# EasyEDA Pro project OURs_PHONE_EPRO_FILE_2025-04-21.epro, board 1-PCB_PCB_OURS PHONE_CONNECTORS_FLIP_1
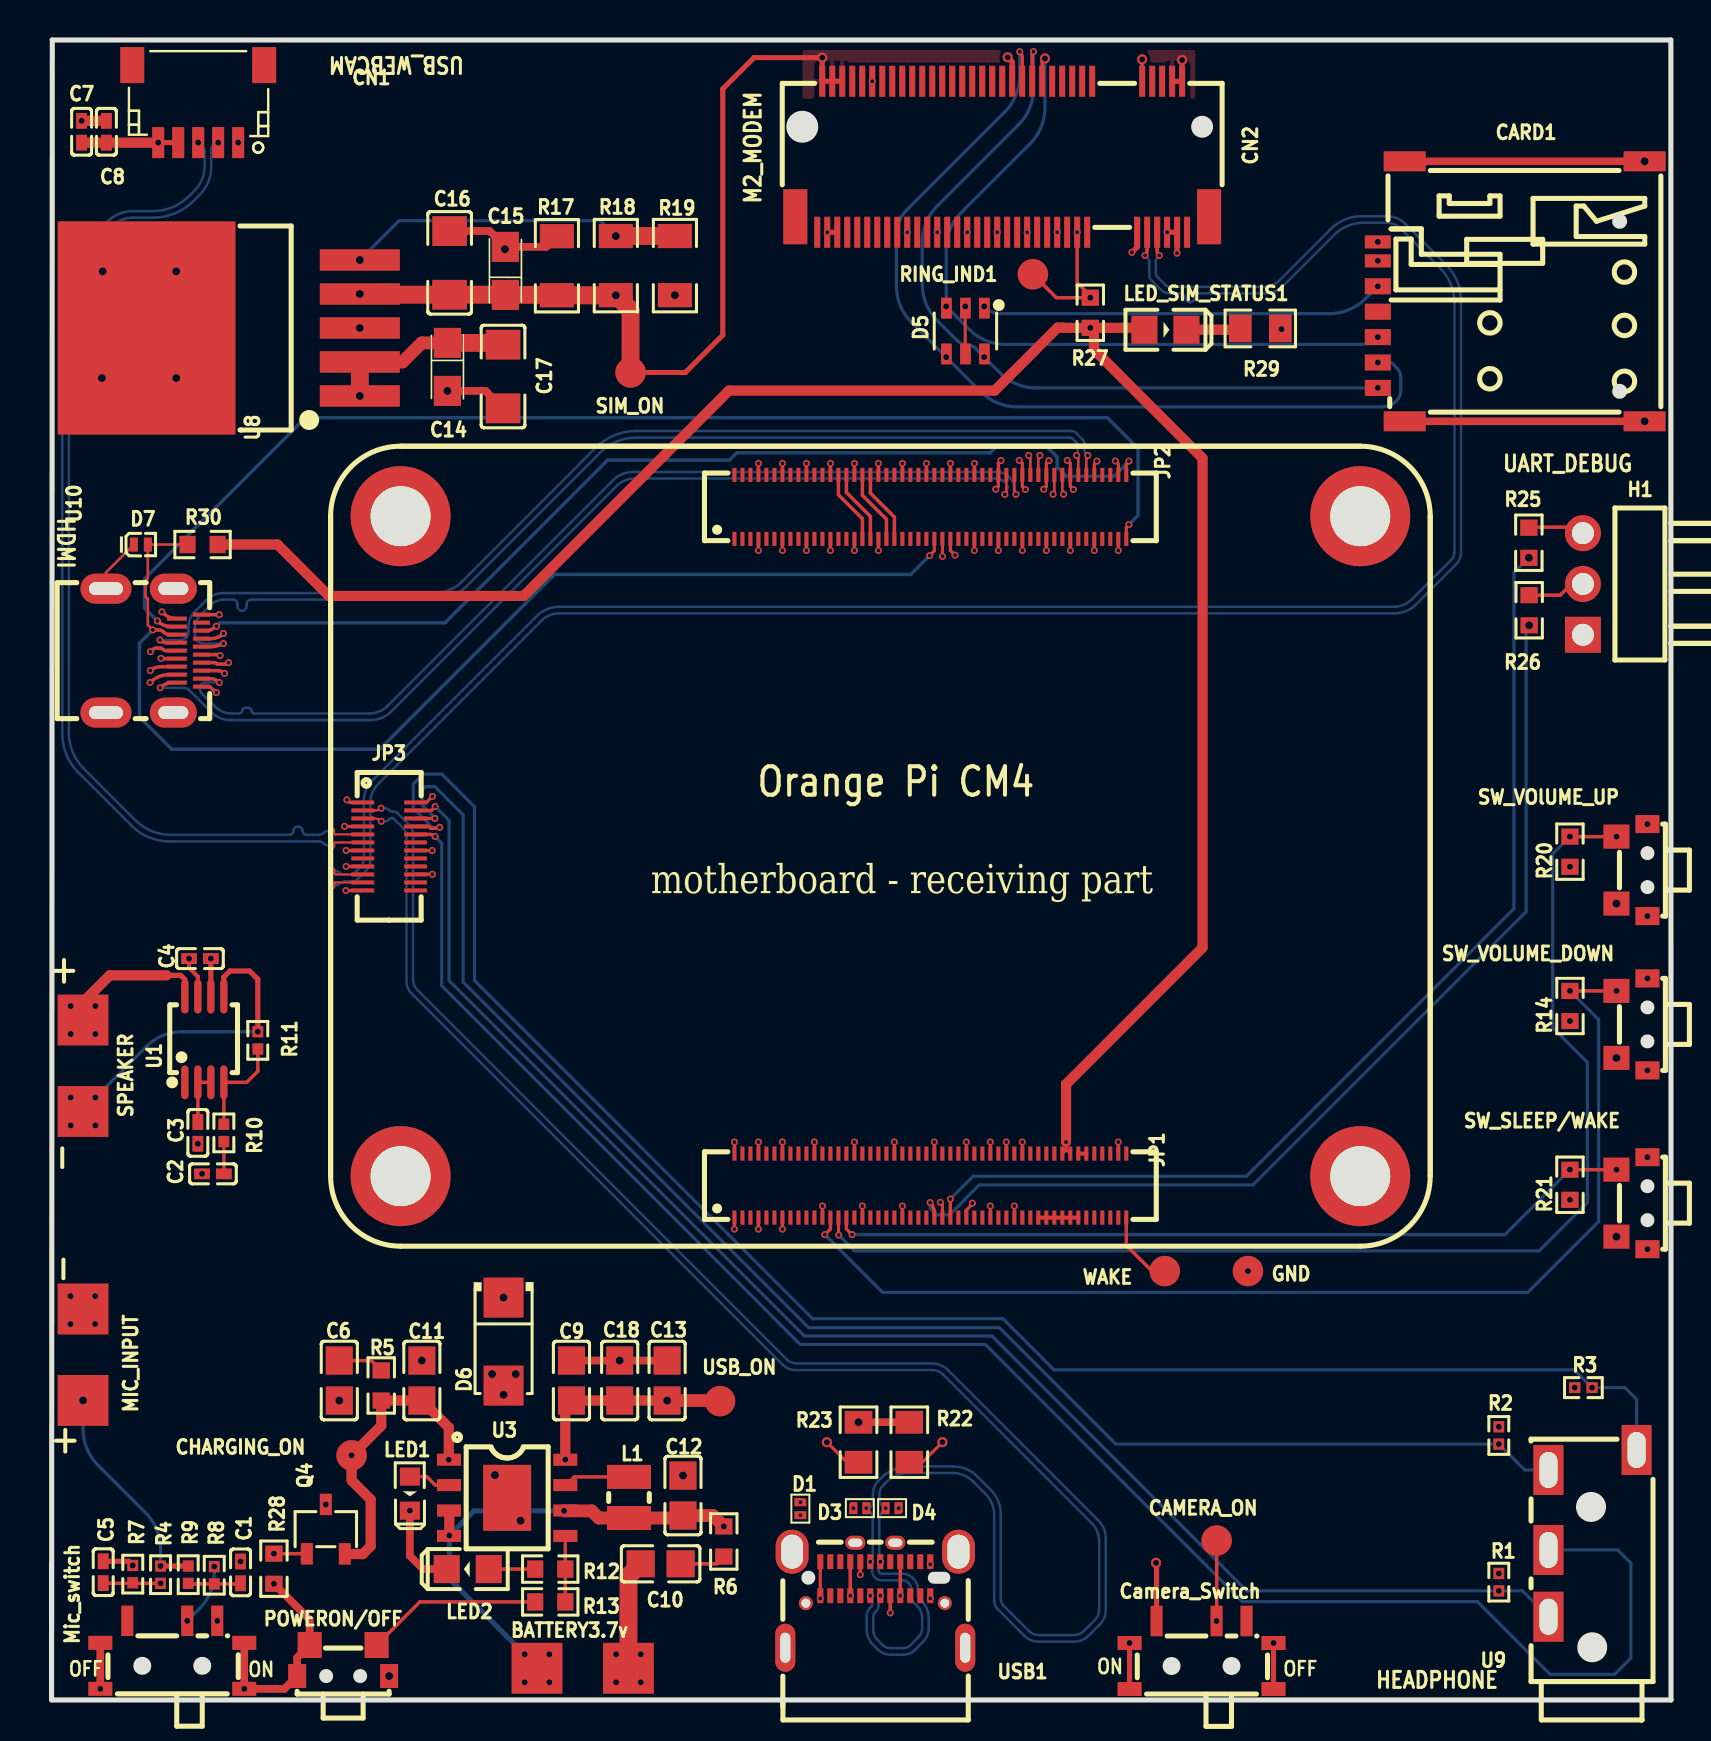
[diagram p12: board, top side]
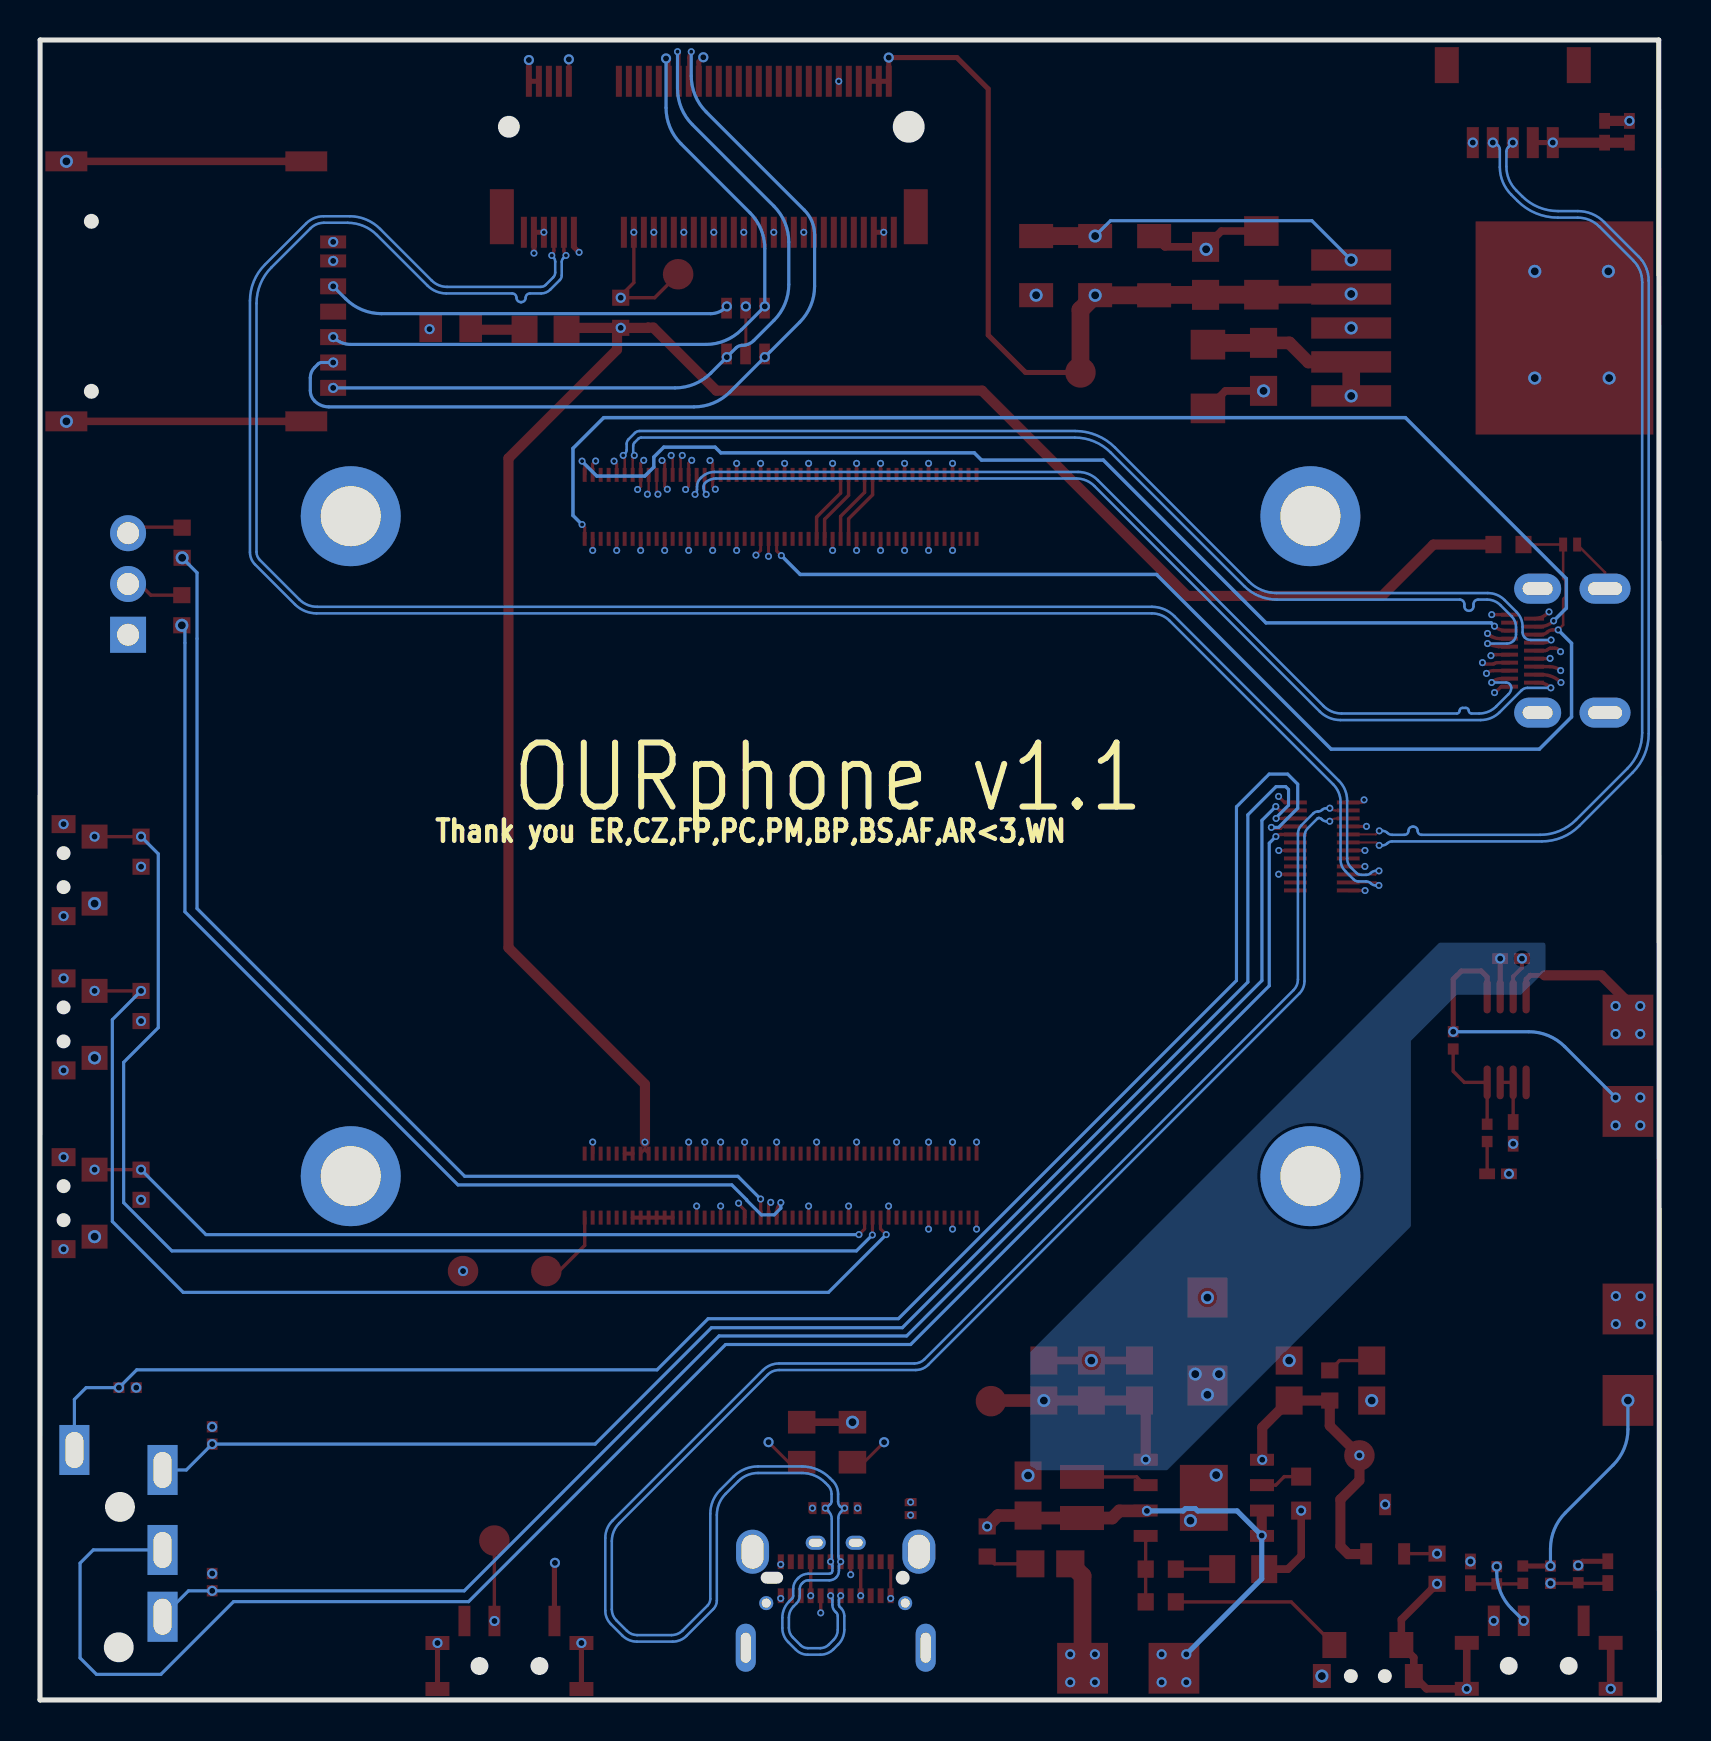
[diagram p13: board, bottom side, seen from below]

Outline 81 x 83 mm; copper layers: Top Layer, L2SP_INR, L3PN_GND, Bottom Layer. Coordinates in mm from the lower left corner of the outline.
Outline path: 0,0 0.03,83 80.99,83 81,0 0,0
Stack: Top Layer 0.035mm Outer layer thickness 1oz / Prepreg1 0.0994mm 3313 RC57% 4.2mil / L2SP_INR 0.0152mm Inner layer thickness / Core 1.265mm 1.3mm H/HOZ with Copper / L3PN_GND 0.0152mm Inner layer thickness / Prepreg2 0.0994mm 3313 RC57% 4.2mil / Bottom Layer 0.035mm Outer layer thickness 1oz

## Design rules (mm)
net HDMI_TX2_P: DP4
net HDMI_TX2_N: DP4
net HDMI_TX1_P: DP3
net HDMI_TX1_N: DP3
net HDMI_TX0_P: DP1
net HDMI_TX0_N: DP1
net HDMI_TXCLK_P: DP2
net HDMI_TXCLK_N: DP2
net USB2_HOST2_N: DP6
net USB2_HOST2_P: DP6
net USB3_HOST1_P: DP5
net USB3_HOST1_N: DP5
net USB2_HOST3_P: DP7
net USB2_HOST3_N: DP7
template: User Custom Config
spacing Default (default): track to track 0.076, other pairs 0 to 0.152
track width Default (default): min 0.051, default 0.127, max 1.27
differential pair Default (default): width min 0.107, default 0.107, max 0.124; gap min 0.203, default 0.203
via Default (default): diameter min 0.178, default 0.762, max 100.025; hole min 0.15, default 0.61, max 59.995

## Placement (name value [footprint] x y rotation side)
BATTERY3.7v  NOB  [BATTERY SYMBOL]  30.12 0.44 0 top
C1  10uF  [C0402]  9.45 6.38 270 top
C2  390nF  [C0402]  8.07 26.31 0 top
C3  1uF  [C0402]  7.31 28.35 90 top
C4  1uF  [C0402]  7.42 37.07 0 top
C5  100nF  [C0402]  2.58 6.39 270 top
C6  10uF  [C0805]  14.39 15.97 90 top
C7  100nF  [C0402]  1.5 78.41 270 top
C8  10uF  [C0402]  2.74 78.41 90 top
C9  22uF  [C0805]  26 15.97 270 top
C10  10uF  [C0805]  30.46 6.81 0 top
C11  10uF  [C0805]  18.52 15.97 270 top
C12  10uF  [C0805]  31.58 10.22 270 top
C13  22uF  [C0805]  30.79 15.97 270 top
C14  100uF  [CASE-A_3216]  19.8 66.65 270 top
C15  330uF  [CASE-A_3216]  22.7 71.46 90 top
C16  0.1u  [C1206]  19.91 71.86 270 top
C17  1uF  [C1206]  22.58 66.17 90 top
C18  22uF  [C0805]  28.41 15.97 270 top
CAMERA_ON  TP-橘色测试点  [TESTPOINT-TH_BD3.2]  58.27 7.97 180 top
Camera_Switch  HX MSK12C02-HB  [SW-SMD_MSK12C02-HB]  57.52 2.25 0 top
CARD1  SMN-303  [SIM-SMD_SMN-303]  73.01 70.43 90 top
CHARGING_ON  TP-橘色测试点  [TESTPOINT-TH_BD3.2]  15 12.23 270 top
CN1  SM05B-SRSS-TB (LF)(SN)  [CONN-SMD_SM05B-SRSS-TB-LF-SN]  7.33 79.81 180 top
CN2  AS0BC21-S30BB-7H  [CONN-SMD_AS0BC21-S30BB-7H]  47.55 77.16 180 top
D1  AZ5825-01F  [DFN-2L_L1.0-W0.6-P0.65-BI]  37.45 9.57 270 top
D3  AZ5825-01F  [DFN-2L_L1.0-W0.6-P0.65-BI]  40.43 9.59 0 top
D4  AZ5825-01F  [DFN-2L_L1.0-W0.6-P0.65-BI]  42.04 9.59 180 top
D5  DT1042-04SO-7  [SOT-26_L3.0-W1.6-P0.95-LS2.8-BL]  45.71 68.45 180 top
D6  M7  [SMA_L4.3-W2.6-LS5.2-RD]  22.61 17.92 270 top
D7  PESD5V0S1UL,315  [SOD-882_L1.0-W0.6-RD]  4.46 57.77 0 top
GND  TP-橘色测试点  [TESTPOINT-TH_BD3.2]  59.84 21.44 0 top
H1  PZ254R-11-03P  [HDR-TH_3P-P2.54-H-M-W10.4]  76.59 55.8 90 top
JP1  DF40C-100DS-0.4V(51)  [CONN-SMD_DF40C-100DS-0.4V-51]  43.95 25.72 180 top
JP2  DF40C-100DS-0.4V(51)  [CONN-SMD_DF40C-100DS-0.4V-51]  43.95 59.66 180 top
JP3  DF40C-24DS-0.4V(51)  [CONN-SMD_DF40C-24DS-0.4V51]  16.88 42.68 90 top
L1  1uH  [IND-SMD_L2.5-W2.0]  28.88 10.12 90 top
LED1  LED-0603_G  [LED0603_GREEN]  17.92 10.32 270 top
LED2  LED-0805_G  [LED0805_GREEN]  20.81 6.54 180 top
LED_SIM_STATUS1  LED-0805_B  [LED0805_BLUE]  55.71 68.51 0 top
MIC_INPUT  NOB  [BATTERY SYMBOL]  2.72 20.82 90 top
Mic_switch  HX MSK12C02-HB  [SW-SMD_MSK12C02-HB]  6.03 2.26 0 top
NOREF  -  [Pad_e1061]  65.46 59.19 0 top
NOREF#2  -  [Pad_e1064]  17.46 59.19 0 top
NOREF#3  -  [Pad_e1063]  17.46 26.19 0 top
NOREF#4  -  [Pad_e1062]  65.46 26.19 0 top
POWERON/OFF  TS24CA  [SW-SMD_TS24CA]  14.58 1.97 180 top
Q4  IRLML6344TRPBF  [SOT-23-3_L2.9-W1.6-P1.90-LS2.8-BR]  13.72 8.54 270 top
R1  470Ω  [R0402]  72.39 5.89 270 top
R2  470Ω  [R0402]  72.39 13.23 270 top
R3  0Ω  [R0402]  76.62 15.62 0 top
R4  100kΩ  [R0402]  5.45 6.26 270 top
R5  2R  [R0603]  16.49 15.72 90 top
R6  2R  [R0603]  33.62 7.92 270 top
R7  100kΩ  [R0402]  4.06 6.29 270 top
R8  22Ω  [R0402]  8.14 6.24 90 top
R9  2.2kΩ  [R0402]  6.83 6.26 270 top
R10  20kΩ  [R0402]  8.61 28.35 90 top
R11  20kΩ  [R0402]  10.31 32.98 270 top
R12  20R  [R0603]  24.94 6.54 180 top
R13  10K  [R0603]  24.94 4.9 180 top
R14  10K  [R0603]  75.94 34.7 90 top
R17  470  [R1206]  25.27 71.71 90 top
R18  100K  [R1206]  28.22 71.72 90 top
R19  47K  [R1206]  31.18 71.72 270 top
R20  10K  [R0603]  75.94 42.42 90 top
R21  10K  [R0603]  75.94 25.76 90 top
R22  5.1K  [R0805]  42.9 12.89 90 top
R23  5.1K  [R0805]  40.36 12.89 270 top
R25  1kΩ  [R0603]  73.89 57.86 90 top
R26  1kΩ  [R0603]  73.9 54.49 90 top
R27  10K  [R0603]  51.95 69.36 90 top
R28  10K  [R0603]  11.12 6.56 90 top
R29  100Ω  [R0805]  60.46 68.58 180 top
R30  10K  [R0603]  7.55 57.77 0 top
RING_IND1  TP-橘色测试点  [TESTPOINT-TH_BD3.2]  49.08 71.29 180 top
SIM_ON  TP-橘色测试点  [TESTPOINT-TH_BD3.2]  28.96 66.38 0 top
SPEAKER  NOB  [BATTERY SYMBOL]  0.43 28.16 270 top
SW_SLEEP/WAKE  TS24CA  [SW-SMD_TS24CA]  79.05 24.84 270 top
SW_VOLUME_DOWN  TS24CA  [SW-SMD_TS24CA]  79.05 33.78 270 top
SW_VOlUME_UP  TS24CA  [SW-SMD_TS24CA]  79.05 41.49 270 top
U1  LM4990MM/NOPB  [MSOP-8_L3.0-W3.0-P0.65-LS5.0-BL]  7.64 33.03 0 top
U3  IP5306  [ESOP-8_L4.9-W3.9-P1.27-LS6.0-BL-EP]  22.79 10.11 270 top
U8  MIC29302WU  [TO-263-5_L10.2-W9.9-P1.70-LS14.4-TL]  10.08 68.6 180 top
U9  PJ-3200B-4A  [AUDIO-TH_PJ-3200B-4A]  77.07 8.33 90 top
U10  GT-HD004A-PNNG0  [HDMI-SMD_GT-HD004A-FNNG0]  5.11 52.47 270 top
USB1  UT12113-11601-7H  [USB-C-SMD_UT12113-11601-7H]  41.2 5.24 0 top
USB_ON  TP-橘色测试点  [TESTPOINT-TH_BD3.2]  33.43 14.94 270 top
WAKE  TP-橘色测试点  [TESTPOINT-TH_BD3.2]  55.68 21.44 0 top

## Footprints (pads in the part's own frame, mm; a bottom-side part is the same pattern mirrored in y, then rotated)
AUDIO-TH_PJ-3200B-4A
  rect 2.5x1.5 hole 1.8x0.9: 1(4.17,-2.204) 2(3.17,2.204) 3(-4.17,2.204) 4(-0.831,2.204)
BATTERY SYMBOL
  rect 2.54x2.54 smd: 1(-5.842,1.143) 2(-1.27,1.143)
C0402
  rect 0.79x0.54 smd: 1(-0.545,0) 2(0.545,0)
C0805
  rect 1.41x1.35 smd: 1(-1,0) 2(1,0)
C1206
  rect 1.485x1.728 smd: 1(-1.593,0) 2(1.593,0)
CASE-A_3216
  rect 1.5x1.359 smd: 1(-1.2,0) 2(1.2,0)
CONN-SMD_AS0BC21-S30BB-7H
  rect 0.3x1.55 smd: 1(-9.25,3.775) 2(-9,-3.775) 3(-8.75,3.775) 4(-8.5,-3.775) 5(-8.25,3.775) 6(-8,-3.775) 7(-7.75,3.775) 8(-7.5,-3.775) 9(-7.25,3.775) 10(-7,-3.775) 11(-6.75,3.775) 20(-4.5,-3.775) 21(-4.25,3.775) 22(-4,-3.775) 23(-3.75,3.775) 24(-3.5,-3.775) 25(-3.25,3.775) 26(-3,-3.775) 27(-2.75,3.775) 28(-2.5,-3.775) 29(-2.25,3.775) 30(-2,-3.775) 31(-1.75,3.775) 32(-1.5,-3.775) 33(-1.25,3.775) 34(-1,-3.775) 35(-0.75,3.775) 36(-0.5,-3.775) 37(-0.25,3.775) 38(0,-3.775) 39(0.25,3.775) 40(0.5,-3.775) 41(0.75,3.775) 42(1,-3.775) 43(1.25,3.775) 44(1.5,-3.775) 45(1.75,3.775) 46(2,-3.775) 47(2.25,3.775) 48(2.5,-3.775) 49(2.75,3.775) 50(3,-3.775) 51(3.25,3.775) 52(3.5,-3.775) 53(3.75,3.775) 54(4,-3.775) 55(4.25,3.775) 56(4.5,-3.775) 57(4.75,3.775) 58(5,-3.775) 59(5.25,3.775) 60(5.5,-3.775) 61(5.75,3.775) 62(6,-3.775) 63(6.25,3.775) 64(6.5,-3.775) 65(6.75,3.775) 66(7,-3.775) 67(7.25,3.775) 68(7.5,-3.775) 69(7.75,3.775) 70(8,-3.775) 71(8.25,3.775) 72(8.5,-3.775) 73(8.75,3.775) 74(9,-3.775) 75(9.25,3.775)
  rect 1.2x2.75 smd: 76(10.35,3) 77(-10.35,3)
CONN-SMD_DF40C-24DS-0.4V51
  rect 0.2x1.14 smd: 1(2.2,1.32) 2(2.2,-1.32) 3(1.8,1.32) 4(1.8,-1.32) 5(1.4,1.32) 6(1.4,-1.32) 7(1,1.32) 8(1,-1.32) 9(0.6,1.32) 10(0.6,-1.32) 11(0.2,1.32) 12(0.2,-1.32) 13(-0.2,1.32) 14(-0.2,-1.32) 15(-0.6,1.32) 16(-0.6,-1.32) 17(-1,1.32) 18(-1,-1.32) 19(-1.4,1.32) 20(-1.4,-1.32) 21(-1.8,1.32) 22(-1.8,-1.32) 23(-2.2,1.32) 24(-2.2,-1.32)
CONN-SMD_DF40C-100DS-0.4V-51
  rect 0.2x0.7 smd: 1(9.8,1.6) 2(9.8,-1.6) 3(9.4,1.6) 4(9.4,-1.6) 5(9,1.6) 6(9,-1.6) 7(8.6,1.6) 8(8.6,-1.6) 9(8.2,1.6) 10(8.2,-1.6) 11(7.8,1.6) 12(7.8,-1.6) 13(7.4,1.6) 14(7.4,-1.6) 15(7,1.6) 16(7,-1.6) 17(6.6,1.6) 18(6.6,-1.6) 19(6.2,1.6) 20(6.2,-1.6) 21(5.8,1.6) 22(5.8,-1.6) 23(5.4,1.6) 24(5.4,-1.6) 25(5,1.6) 26(5,-1.6) 27(4.6,1.6) 28(4.6,-1.6) 29(4.2,1.6) 30(4.2,-1.6) 31(3.8,1.6) 32(3.8,-1.6) 33(3.4,1.6) 34(3.4,-1.6) 35(3,1.6) 36(3,-1.6) 37(2.6,1.6) 38(2.6,-1.6) 39(2.2,1.6) 40(2.2,-1.6) 41(1.8,1.6) 42(1.8,-1.6) 43(1.4,1.6) 44(1.4,-1.6) 45(1,1.6) 46(1,-1.6) 47(0.6,1.6) 48(0.6,-1.6) 49(0.2,1.6) 50(0.2,-1.6) 51(-0.2,1.6) 52(-0.2,-1.6) 53(-0.6,1.6) 54(-0.6,-1.6) 55(-1,1.6) 56(-1,-1.6) 57(-1.4,1.6) 58(-1.4,-1.6) 59(-1.8,1.6) 60(-1.8,-1.6) 61(-2.2,1.6) 62(-2.2,-1.6) 63(-2.6,1.6) 64(-2.6,-1.6) 65(-3,1.6) 66(-3,-1.6) 67(-3.4,1.6) 68(-3.4,-1.6) 69(-3.8,1.6) 70(-3.8,-1.6) 71(-4.2,1.6) 72(-4.2,-1.6) 73(-4.6,1.6) 74(-4.6,-1.6) 75(-5,1.6) 76(-5,-1.6) 77(-5.4,1.6) 78(-5.4,-1.6) 79(-5.8,1.6) 80(-5.8,-1.6) 81(-6.2,1.6) 82(-6.2,-1.6) 83(-6.6,1.6) 84(-6.6,-1.6) 85(-7,1.6) 86(-7,-1.6) 87(-7.4,1.6) 88(-7.4,-1.6) 89(-7.8,1.6) 90(-7.8,-1.6) 91(-8.2,1.6) 92(-8.2,-1.6) 93(-8.6,1.6) 94(-8.6,-1.6) 95(-9,1.6) 96(-9,-1.6) 97(-9.4,1.6) 98(-9.4,-1.6) 99(-9.8,1.6) 100(-9.8,-1.6)
CONN-SMD_SM05B-SRSS-TB-LF-SN
  rect 0.6x1.55 smd: 1(-2,1.938) 2(-0.999,1.938) 3(0.001,1.938) 4(1,1.938) 5(2.001,1.938)
  rect 1.2x1.8 smd: 6(-3.3,-1.938) 7(3.3,-1.938)
DFN-2L_L1.0-W0.6-P0.65-BI
  custom 0.41x0.6 smd: 1(-0.325,0)
  rect 0.4x0.6 smd: 2(0.325,0)
ESOP-8_L4.9-W3.9-P1.27-LS6.0-BL-EP
  rect 0.6x1.2 smd: 1(-1.905,-2.909) 2(-0.635,-2.909) 3(0.635,-2.909) 4(1.905,-2.909) 5(1.905,2.909) 6(0.635,2.909) 7(-0.635,2.909) 8(-1.905,2.909)
  rect 3.3x2.4 smd: 9(0,0)
HDMI-SMD_GT-HD004A-FNNG0
  rect 0.2x0.85 smd: 1(1.8,2.388) 3(1.4,2.388) 5(1,2.388) 7(0.6,2.388) 9(0.2,2.388) 11(-0.2,2.388) 13(-0.6,2.388) 15(-1,2.388) 17(-1.4,2.388) 19(-1.8,2.388)
  rect 0.2x1 smd: 2(1.6,1.163) 4(1.2,1.163) 6(0.8,1.163) 8(0.4,1.163) 10(0,1.163) 12(-0.4,1.163) 14(-0.8,1.163) 16(-1.2,1.163) 18(-1.6,1.163)
  oval 1.5x2.35 hole 0.65x1.5: 20(-3.1,0.983) 20(3.1,0.983)
  oval 1.5x2.55 hole 0.65x1.7: 21(-3.1,-2.388) 21(3.1,-2.388)
HDR-TH_3P-P2.54-H-M-W10.4
  rect 1.8x1.8 hole 1.1: 1(-2.54,0)
  round 1.8 hole 1.1: 2(0,0) 3(2.54,0)
IND-SMD_L2.5-W2.0
  rect 1.2x2.2 smd: 1(1.028,0) 2(-1.028,0)
LED0603_GREEN
  rect 0.9x1 smd: 1(-0.85,0) 2(0.85,0)
LED0805_BLUE
  rect 1.3x1.399 smd: 1(-1.05,0) 2(1.05,0)
LED0805_GREEN
  rect 1.3x1.399 smd: 1(-1.05,0) 2(1.05,0)
MSOP-8_L3.0-W3.0-P0.65-LS5.0-BL
  oval 0.364x1.692 smd: 1(-0.975,-2.146) 2(-0.325,-2.146) 3(0.325,-2.146) 4(0.975,-2.146) 5(0.975,2.146) 6(0.325,2.146) 7(-0.325,2.146) 8(-0.975,2.146)
Pad_e1061
  round 5 hole 3: 101(0,0)
Pad_e1062
  round 5 hole 3: 101(0,0)
Pad_e1063
  round 5 hole 3: 101(0,0)
Pad_e1064
  round 5 hole 3: 101(0,0)
R0402
  rect 0.566x0.54 smd: 1(-0.433,0) 2(0.433,0)
R0603
  rect 0.806x0.864 smd: 1(-0.753,0) 2(0.753,0)
R0805
  rect 1.133x1.377 smd: 1(-1,0) 2(1,0)
R1206
  rect 1.208x1.701 smd: 1(-1.479,0) 2(1.479,0)
SIM-SMD_SMN-303
  rect 1x2.1 smd: 8(-6.5,5.328) 9(6.5,5.328) 10(6.5,-6.672) 11(-6.5,-6.672)
  rect 0.8x1.3 smd: C1(0.25,6.672) C2(-2.29,6.672) C3(-4.83,6.672) C6(-1.02,6.672) C7(-3.56,6.672)
  rect 0.65x1.3 smd: C5(1.52,6.672) CD(2.47,6.672)
SMA_L4.3-W2.6-LS5.2-RD
  rect 2x2 smd: 1(-2.2,0) 2(2.2,0)
SOD-882_L1.0-W0.6-RD
  rect 0.4x0.7 smd: 1(-0.35,0) 2(0.35,0)
SOT-23-3_L2.9-W1.6-P1.90-LS2.8-BR
  rect 1.07x0.6 smd: 1(1.235,-0.95) 2(1.235,0.95) 3(-1.235,0)
SOT-26_L3.0-W1.6-P0.95-LS2.8-BL
  rect 0.532x1.04 smd: 1(-0.95,-1.145) 2(0,-1.145) 3(0.95,-1.145) 4(0.95,1.145) 5(0,1.145) 6(-0.95,1.145)
SW-SMD_MSK12C02-HB
  rect 0.6x1.524 smd: 1(-2.25,1.7) 2(0.75,1.7) 3(2.25,1.7)
  rect 1.2x0.7 smd: 4(-3.6,0.6) 4(-3.6,-1.7) 4(3.6,0.6) 4(3.6,-1.7)
SW-SMD_TS24CA
  rect 0.9x1.2 smd: 1(-2.3,0.775) 2(2.3,0.775)
  rect 1.2x1.3 smd: 3(-1.675,-0.775) 4(1.675,-0.775)
TESTPOINT-TH_BD3.2
  round 1.524 smd: 1(0,0)
TO-263-5_L10.2-W9.9-P1.70-LS14.4-TL
  rect 4x1.069 smd: 1(-5.334,3.4) 2(-5.334,1.7) 3(-5.334,0) 4(-5.334,-1.7) 5(-5.334,-3.4)
  rect 8.89x10.66 smd: 6(5.334,0)
USB-C-SMD_UT12113-11601-7H
  round 0.7 hole 0.45: 1(-3.474,-0.395) 1(3.475,-0.395)
  oval 1x2.4 hole 0.5x1.5: 2(-4.5,-2.625) 2(4.5,-2.625)
  oval 1x0.7 hole 0.7x0.4: 2(-1,2.625) 2(1,2.625)
  oval 1.65x2.2 hole 1.1x1.7: 13(-4.16,2.176) 13(4.16,2.176)
  rect 0.3x0.74 smd: A1(-2.75,1.675) A2(-2.249,1.675) A3(-1.75,1.675) A4(-1.25,1.675) A5(-0.75,1.675) A6(-0.249,1.675) A7(0.25,1.675) A8(0.75,1.675) A9(1.25,1.675) A10(1.75,1.675) A11(2.25,1.675) A12(2.751,1.675) B1(2.751,-0.025) B2(2.251,-0.025) B3(1.75,-0.025) B4(1.25,-0.025) B5(0.75,-0.025) B6(0.251,-0.025) B7(-0.249,-0.025) B8(-0.75,-0.025) B9(-1.25,-0.025) B10(-1.75,-0.025) B11(-2.249,-0.025) B12(-2.749,-0.025)

## Nets
As in the schematic.

Pads without a net: Camera_Switch 3; CARD1 C6; CN1 6 7; CN2 1 6 8 20 21 22 24 25 26 28 29 31 35 37 38 40 41 42 43 44 46 47 48 49 50 52 53 54 55 56 58 59 60 61 62 63 65 66 67 68 69 75 76 77; JP1 3 4 5 6 9 10 11 12 15 16 17 18 19 20 21 24 26 28 30 31 34 35 36 37 38 39 40 41 44 45 46 47 48 49 50 54 56 57 58 61 62 63 64 67 68 69 72 73 75 76 78 80 82 89 91 92 93 94 95 96 97 100; JP2 1 2 3 4 5 6 9 10 11 12 15 16 17 18 21 22 23 24 27 29 40 42 43 45 46 47 48 49 52 54 57 58 59 60 63 64 65 66 69 71 75 77 81 83 87 89 93 94 95 96; JP3 12 15 16 18 22 24; Mic_switch 1; NOREF 101; NOREF#2 101; NOREF#3 101; NOREF#4 101; U1 1; U10 17; USB1 13 A2 A3 A8 A10 A11 B2 B3 B8 B10 B11

## Via types
v1: diameter 0.353, hole 0.201, Top Layer to Bottom Layer, 143 vias
v2: diameter 0.508, hole 0.299, Top Layer to Bottom Layer, 96 vias
v3: diameter 0.653, hole 0.399, Top Layer to Bottom Layer, 34 vias

## Routing (per net, layer and track width the routed paths; a pad name or vN(x,y) marks a point on that pad's centre or on a via; arc(x,y) is an arc through that point)
+5V: length 34.9
  Top Layer w0.17: v1(5.52,54.41) 5.57,54.36 arc(5.89,54.14) U10.18
  Top Layer w0.254: U1.6 v2(7.96,37.07) ; Camera_Switch.1 55.27,6.83 v2(55.24,6.86)
  Top Layer w0.508: C8.2 v2(1.5,78.96) ; v2(25.69,12.02) 25.69,14.66 C9.2 C18.2 v3(30.79,14.97)
  Top Layer w0.635: C14.1 18.51,67.85 17.55,66.9 U8.2 ; v3(30.79,14.97) 33.4,14.97 USB_ON.1
  Top Layer w0.889: v3(15.42,65.2) U8.2 ; C17.2 22.58,67.85 C14.1
  L2SP_INR w0.305: 0.96,54.2 4.01,54.2 4.32,54.5 ; v1(5.52,54.41) 5.42,54.5 4.32,54.5 ; 4.32,54.5 0.95,54.5
  vias: v3(22.03,16.29) v3(22.61,15.26) v3(23.22,16.29)
GND: length 134.3
  Top Layer w0.127: D7.1 2.72,56.38 U10.21
  Top Layer w0.15: v2(45.7,69.68) 45.7,67.31 D5.5
  Top Layer w0.152: v1(49.89,61.97) 49.89,61.96 49.75,61.83 JP2.80 49.75,60.68 49.62,60.55 v1(49.62,60.54) ; JP2.55 44.95,57.48 v1(45.19,57.24) ; v1(50.8,61.98) 50.95,61.83 JP2.86 50.95,60.68 v1(51.11,60.53) ; v1(38.95,57.48) JP2.25 ; v1(47.35,57.48) JP2.67 ; v1(50.95,57.48) JP2.85 ; JP1.7 v1(35.35,23.54) ; v1(38.45,5.08) 38.45,6.78 ; v1(46.15,57.48) JP2.61 ; v1(44.15,27.9) 44.15,27.32 ; v1(48.55,27.9) 48.55,27.32 ; v1(38.95,61.83) JP2.26 ; v1(35.35,57.48) JP2.7 ; v1(42.55,24.7) JP1.43 ; v1(48.71,60.53) 48.55,60.68 JP2.74 48.55,61.83 v1(48.4,61.98) ; v1(42.15,27.9) 42.15,27.32 ; v1(40.15,57.48) JP2.31 ; v1(44.95,61.83) JP2.56 ; v1(38.55,24.7) JP1.23 ; JP1.1 v1(34.15,23.54) ; JP2.98 53.36,61.26 53.36,61.79 v1(53.21,61.95) ; v1(35.35,27.9) 35.35,27.32 ; v1(52.15,57.48) JP2.91 ; 52.29,61.93 52.15,61.8 JP2.92 ; JP1.59 45.74,24.13 45.74,24.48 46.06,24.79 v1(46.06,24.84) ; v1(37.75,61.83) JP2.20 ; JP3.7 14.66,43.68 v1(14.65,43.68) ; v1(41.35,61.83) JP2.38 ; v1(48.15,24.7) JP1.71 ; v1(37.75,57.48) JP2.19 ; JP1.13 v1(36.55,23.54) ; v1(43.75,61.83) JP2.50 ; JP1.53 44.56,24.12 44.56,24.77 v1(44.45,24.88) ; v1(47.22,60.54) 47.22,60.55 47.35,60.68 JP2.68 47.35,61.83 47.49,61.96 ; v1(45.75,27.9) 45.75,27.32 ; v1(48.55,57.48) JP2.73 ; v1(46.15,61.83) JP2.62 ; v1(41.35,57.48) JP2.37 ; v1(46.95,27.9) 46.95,27.32 ; v1(49.75,57.48) JP2.79 ; v1(53.35,27.9) 53.35,27.32 ; v1(38.15,27.9) 38.15,27.32 ; v1(36.55,61.83) JP2.14 ; v1(40.55,24.7) JP1.33 ; v1(40.15,61.83) JP2.32 ; v1(35.35,61.83) JP2.8 ; v1(36.55,27.9) 36.55,27.32 ; v1(36.55,57.48) JP2.13 ; v1(34.15,27.9) 34.15,27.32 ; v1(42.55,61.83) JP2.44 ; v1(46.95,24.7) JP1.65 ; v1(53.35,57.48) JP2.97 ; v1(40.15,27.9) 40.15,27.32
  Top Layer w0.158: JP3.13 v1(14.73,42.48) ; 15.56,40.47 14.72,40.47 ; 18.2,42.47 v1(19.04,42.47) ; 18.22,44.88 18.75,44.88 v1(19.05,45.18) ; 15.57,41.68 14.73,41.68 ; 15.57,44.87 14.9,44.87 v1(14.77,45.01) ; 18.21,41.29 19.04,41.29
  Top Layer w0.17: v1(8.25,50.37) 8.21,50.37 7.91,50.67 7.49,50.67 ; U10.10 5.71,52.47 arc(5.65,52.48) 5.6,52.52 arc(5.53,52.56) 5.46,52.59 arc(5.4,52.59) 5.35,52.59 5.23,52.59 arc(5.13,52.57) 5.04,52.52 v1(4.94,52.41) ; 7.49,51.87 8.14,51.87 arc(8.2,51.86) 8.25,51.82 arc(8.28,51.8) 8.31,51.8 8.68,51.8 arc(8.77,51.82) v1(8.85,51.87) ; 7.49,53.07 7.97,53.07 arc(8.17,53.09) 8.36,53.16 arc(8.4,53.18) 8.44,53.2 arc(8.52,53.26) v1(8.6,53.33) ; U10.4 5.87,51.27 arc(5.36,51.17) v1(4.92,50.87)
  Top Layer w0.203: v2(6.87,37.07) 6.87,36.61 7.31,36.17 U1.7
  Top Layer w0.254: v1(54.03,72.38) 54.3,72.65 CN2.11 ; v2(53.92,2.85) Camera_Switch.4 ; v2(61.12,2.85) Camera_Switch.4 ; v1(56.29,72.34) 56.29,73.38 CN2.3 v1(55.8,73.39) ; CN2.71 v1(38.8,73.39) ; C5.1 3.85,6.94 v2(4.06,6.72) ; CN1.4 v2(5.33,77.87)
  Top Layer w0.381: v3(79.68,63.93) CARD1.8 ; 9.64,2.86 v2(9.64,0.56) 11.64,0.56 POWERON/OFF.2 12.28,2.12 POWERON/OFF.4 12.91,4.02 v2(11.12,5.81) ; CARD1.9 v3(79.68,76.93) ; C13.1 v3(28.41,16.97) C9.1 ; R22.2 v3(40.36,13.89) ; C17.1 21.71,65.45 v3(19.8,65.45) ; C16.1 21.91,73.45 C15.2 24.74,72.66 R17.2 ; v2(17.92,9.47) 17.92,7.21 18.58,6.54 LED2.2 ; 2.44,2.92 v2(2.44,0.56)
  Top Layer w0.508: C7.2 C8.1 5.33,77.87 v2(5.33,77.87)
  Top Layer w0.889: BATTERY3.7v.2 28.85,6.2 C10.1
  vias: v1(14.73,41.68) v1(14.72,40.47) v1(19.04,41.29) v1(37.45,9.89) v1(40.1,9.59) v1(42.36,9.59) v1(42.8,73.39) v1(43.95,6.78) v1(43.95,5.08) v1(44.3,73.39) v1(45.8,73.39) v1(47.3,73.39) v1(47.49,61.97) v1(48.8,73.39) v1(50.3,73.39) v1(52.29,61.94) v2(0.94,20.19) v2(0.94,18.8) v2(2.18,20.19) v2(2.18,18.8) v2(7.31,27.81) v2(9.45,6.93) v2(28.23,2.28) v2(28.23,0.89) v2(29.47,2.28) v2(29.47,0.89) v2(59.84,21.44) v2(66.34,71.95) v2(72.39,13.66) v2(72.39,6.32) v2(75.94,41.66) v2(75.94,33.95) v2(75.94,25.01) v2(76.19,15.62) v2(79.82,43.79) v2(79.82,39.19) v2(79.82,36.08) v2(79.82,31.48) v2(79.82,27.14) v2(79.82,22.54) v3(2.51,66.1) v3(2.55,71.43) v3(6.23,71.43) v3(6.23,66.1) v3(14.39,14.97) v3(15.42,68.6) v3(16.88,1.2) v3(18.52,16.97) v3(22.17,11.24) v3(22.67,72.54) v3(23.46,8.96) v3(31.18,70.24) v3(31.58,11.22)
VBAT: length 119.4
  Top Layer w0.254: v2(56.55,82) 56.55,80.94 56.05,80.94 ; 39.55,80.94 38.55,80.94 v2(38.55,82.12) 35.14,82.12 33.57,80.56 33.57,68.25 31.7,66.38 SIM_ON.1
  Top Layer w0.889: v3(15.42,70.3) 15.45,70.26 C16.2 22.7,70.26 C15.1 25.27,70.26 R17.1 v3(28.22,70.23) R18.1 28.96,69.5 SIM_ON.1
  L2SP_INR w0.254: v2(56.55,82) 66.6,82 69.62,78.98 69.62,67.61 67.78,65.78 67.78,65.77 66.77,64.76 42.57,64.76 35.76,71.57 35.76,79.33 v2(38.55,82.12)
VBUS: length 2
  Top Layer w0.203: JP1.87 JP1.85 JP1.83 JP1.81 JP1.79 JP1.77
VCC_1V8: length 0.4
  Top Layer w0.203: 51.75,27.32 51.35,27.32
VCC_3V3: length 210
  Top Layer w0.137: 50.95,27.32 50.74,27.53
  Top Layer w0.152: 50.56,27.32 50.74,27.5 v1(50.74,27.9)
  Top Layer w0.508: R30.2 11.3,57.77 13.87,55.2 23.61,55.2 33.88,65.47 47.17,65.47 50.32,68.62 50.58,68.62 50.59,68.61 v2(51.95,68.61) ; v2(51.95,68.61) 52.14,68.42 52.14,67.52 57.57,62.09 57.57,37.61 50.74,30.79 v1(50.74,27.9) ; v2(51.95,68.61) 54.57,68.61 LED_SIM_STATUS1.1
  L2SP_INR w0.508: v3(78.27,23.17) 77.51,23.92 77.51,29.6 78.27,30.36 v3(78.27,32.1) 77.28,33.09 77.28,36.48 78.27,37.46 v3(78.27,39.82) 62.66,39.82 v1(50.74,27.9) 50.06,27.22 50.06,23.8 48.23,21.97 21.44,21.97 15.55,16.07 15.55,13.94 13.56,11.95 11.19,11.95 7.1,7.85 7.1,5.15 v2(8.28,3.96)
VIN: length 15.3
  Top Layer w0.508: v2(19.87,12.01) 19.87,13.62 C11.2 R5.1 16.49,13.71 v2(15,12.23) 15,10.98 15.96,10.03 15.96,7.69 15.56,7.29 14.68,7.29 Q4.2
BATTERY+: length 23.5
  Top Layer w0.508: v2(19.89,8.22) 19.89,9.46 U3.3
  Top Layer w0.635: v2(33.62,8.68) 33.08,9.22 C12.2 31.45,9.1 L1.2 27.37,9.1 27.01,9.45 v2(25.63,9.45)
  Bottom Layer w0.254: v2(23.66,2.28) 19.89,6.06 v2(19.89,8.22) 21.12,9.45 23.09,9.45 23.21,9.57 23.71,9.57 23.82,9.45 v2(25.63,9.45)
  vias: v2(23.66,0.89) v2(24.9,2.28) v2(24.9,0.89)
CARD_DETECT: length 38.2
  L2SP_INR w0.137: v1(41.05,80.94) 41.05,72.03 arc(41.24,71.06) 41.79,70.24 43.18,68.85 arc(44.33,68.08) 45.67,67.82 56.06,67.82 arc(57.04,68.01) 57.86,68.56 61.46,72.16 arc(62.29,72.71) 63.26,72.9 v2(66.34,72.9)
CC1: length 1.7
  Top Layer w0.17: Q4.1 12.75,7.31 v2(11.12,7.31)
GPIO0_D0(UART2_RX_M0): length 51.7
  Top Layer w0.17: JP1.51 44.15,24.36 arc(44.1,24.64) v1(43.94,24.87)
  Bottom Layer w0.157: v1(43.94,24.87) 43.94,24.59 44.27,24.26 44.92,24.26 45.65,24.99 45.65,25.01 46.4,25.75 60.09,25.75 73.75,39.41 73.75,52.86
  Bottom Layer w0.158: v3(73.9,53.73) 73.75,53.58 73.75,52.86
GPIO0_D1(UART2_TX_M0): length 53
  Top Layer w0.17: JP1.55 v1(44.95,25.05)
  Bottom Layer w0.157: v1(44.95,25.05) 46.09,26.19 59.76,26.19 73.14,39.57 73.14,53.07
  Bottom Layer w0.158: 73.14,53.07 73.14,56.36 v3(73.89,57.11)
GPIO3_D1: length 56.7
  Top Layer w0.158: 38.96,24.02 38.96,23.55 v1(38.67,23.27)
  Top Layer w0.17: 78.27,35.45 v2(75.94,35.45)
  Bottom Layer w0.157: v1(38.67,23.27) 41.56,20.38 73.84,20.38 77.38,23.92 77.38,34.02 v2(75.94,35.45)
  vias: v2(78.27,35.45)
GPIO3_D2: length 61.3
  Top Layer w0.158: v1(39.37,23.25) 39.36,23.26 39.36,24.02
  Top Layer w0.17: v2(78.27,43.17) v2(75.94,43.17)
  Bottom Layer w0.157: v2(75.94,43.17) 75.08,42.31 75.08,33.61 76.82,31.88 76.82,24.87 74.4,22.45 40.16,22.45 v1(39.37,23.25)
GPIO3_D5: length 40.6
  Top Layer w0.158: v1(40.04,23.27) 39.75,23.55 39.75,24.15
  Top Layer w0.17: v2(78.27,26.52) 75.95,26.52
  Bottom Layer w0.157: v1(40.04,23.27) 72.7,23.27 v2(75.94,26.51)
HDMI_CEC_PORT: length 57.5
  Top Layer w0.127: R30.1 D7.2 4.81,56.08 4.7,55.97 4.7,55.17 4.81,55.05 4.81,53.75 v1(5.06,53.5)
  Top Layer w0.152: v1(43.92,57.22) 44.15,57.46 JP2.51
  Top Layer w0.17: U10.14 5.91,53.27 arc(5.75,53.3) 5.61,53.39 arc(5.48,53.48) 5.34,53.5 v1(5.06,53.5)
  Bottom Layer w0.17: v1(5.06,53.5) 4.39,52.84 4.39,49.15 6,47.54 16.42,47.54 25.15,56.28 42.97,56.28 v1(43.92,57.22)
HDMI_TX0_N: length 51.1
  Top Layer w0.124: JP2.84 50.55,60.44 arc(50.57,60.36) v1(50.62,60.29)
  Top Layer w0.17: 7.49,52.27 8.16,52.27 arc(8.3,52.27) v1(8.42,52.22)
  L2SP_INR w0.106: v1(50.62,60.29) 50.61,60.29 arc(50.53,60.16) 50.5,60.01 50.5,59.93 arc(50.45,59.69) 50.32,59.49 50.02,59.19 arc(49.69,58.97) 49.31,58.89 23.57,58.89 arc(23.11,58.8) 22.73,58.55 20,55.81 arc(19.5,55.48) 18.92,55.36 10.11,55.36 arc(10.04,55.33) 10.01,55.26 arc(9.98,55.19) 9.91,55.16 9.66,55.16 arc(9.58,55.19) 9.55,55.26 arc(9.52,55.33) 9.45,55.36 9,55.36 arc(8.65,55.3) 8.36,55.1 7.28,54.02 arc(7.15,53.82) 7.1,53.59 7.1,52.62 arc(7.13,52.48) 7.21,52.36 arc(7.37,52.26) 7.56,52.22 v1(8.42,52.22)
HDMI_TX0_P: length 51
  Top Layer w0.124: JP2.82 50.15,60.44 arc(50.14,60.36) v1(50.09,60.29)
  Top Layer w0.17: U10.8 5.5,52.07 arc(5.47,52.05) v1(5.47,52.08)
  L2SP_INR w0.106: v1(5.47,52.08) 6.53,52.08 arc(6.62,52.1) 6.7,52.15 arc(6.77,52.25) 6.79,52.37 6.79,53.62 arc(6.86,53.94) 7.04,54.22 8.17,55.35 arc(8.53,55.59) 8.96,55.67 18.9,55.67 arc(19.38,55.77) 19.79,56.04 22.54,58.8 arc(22.99,59.1) 23.53,59.2 49.27,59.2 arc(49.57,59.26) 49.82,59.43 50.1,59.71 arc(50.17,59.81) 50.19,59.93 50.19,60.05 arc(50.16,60.18) v1(50.09,60.29)
HDMI_TX1_N: length 70
  Top Layer w0.124: JP2.78 49.35,62.05 arc(49.37,62.15) v1(49.43,62.23)
  Top Layer w0.17: U10.6 5.47,51.67 arc(5.19,51.61) v1(4.94,51.47)
  L2SP_INR w0.106: v1(4.94,51.47) 6.27,51.47 arc(6.41,51.44) 6.53,51.36 arc(6.61,51.24) 6.64,51.1 6.64,51.09 arc(6.68,50.88) 6.8,50.7 8.2,49.3 arc(8.6,49.03) 9.07,48.94 48.25,48.94 arc(48.72,49.03) 49.12,49.3 56.4,56.58 arc(56.71,57.05) 56.83,57.62 56.83,58.97 arc(56.73,59.44) 56.47,59.85 55.46,60.85 arc(54.99,61.17) 54.44,61.28 50.02,61.28 arc(49.74,61.33) 49.51,61.49 49.33,61.66 arc(49.29,61.73) 49.27,61.81 49.27,61.95 arc(49.29,62.06) 49.36,62.16 v1(49.43,62.23)
HDMI_TX1_P: length 70
  Top Layer w0.124: JP2.76 48.95,62.03 arc(48.93,62.14) v1(48.87,62.23)
  Top Layer w0.17: 7.49,51.47 8.31,51.47 arc(8.49,51.43) v1(8.65,51.33)
  L2SP_INR w0.106: v1(8.65,51.33) 7.08,51.33 arc(7.03,51.32) 6.99,51.29 arc(6.96,51.25) 6.95,51.2 6.95,51.14 arc(6.98,51) 7.06,50.88 8.32,49.62 arc(8.73,49.34) 9.22,49.25 9.68,49.25 arc(9.84,49.31) 9.91,49.48 9.91,49.86 arc(10.14,50.09) 10.36,49.86 10.36,49.48 arc(10.43,49.31) 10.59,49.25 48.1,49.25 arc(48.59,49.34) 49,49.62 56.15,56.76 arc(56.42,57.18) 56.52,57.66 56.52,58.83 arc(56.42,59.31) 56.15,59.73 55.28,60.59 arc(54.87,60.87) 54.38,60.97 50.01,60.97 arc(49.62,61.04) 49.3,61.26 49.11,61.45 arc(48.98,61.64) 48.93,61.87 48.93,62.08 arc(48.92,62.16) v1(48.87,62.23)
HDMI_TX2_N: length 50.4
  Top Layer w0.124: JP2.72 48.15,60.48 arc(48.17,60.37) v1(48.24,60.28)
  Top Layer w0.17: 7.49,51.07 7.92,51.07 arc(8.17,51.02) v1(8.39,50.87)
  Bottom Layer w0.124: v1(8.39,50.87) 7.67,50.87 arc(7.48,50.79) 7.41,50.6 arc(7.45,50.43) 7.55,50.29 8.16,49.68 arc(8.55,49.42) 9.01,49.32 9.39,49.32 arc(9.49,49.37) 9.53,49.46 arc(9.58,49.56) 9.67,49.6 9.85,49.6 arc(9.95,49.56) 9.99,49.46 arc(10.03,49.37) 10.13,49.32 15.9,49.32 arc(16.38,49.42) 16.79,49.7 28.09,60.99 arc(28.54,61.3) 29.08,61.4 47.26,61.4 arc(47.62,61.33) 47.92,61.13 47.97,61.08 arc(48.09,60.89) 48.14,60.68 48.14,60.52 arc(48.16,60.39) v1(48.24,60.28)
HDMI_TX2_P: length 50.4
  Top Layer w0.124: JP2.70 47.75,60.46 arc(47.73,60.36) v1(47.68,60.28)
  Top Layer w0.17: U10.2 6.06,50.87 arc(5.72,50.8) v1(5.43,50.61)
  Bottom Layer w0.124: v1(5.43,50.61) 6.59,50.61 arc(6.76,50.57) 6.89,50.48 7.99,49.39 arc(8.42,49.1) 8.93,49 15.95,49 arc(16.51,49.11) 16.99,49.42 28.26,60.7 arc(28.68,60.98) 29.16,61.07 47.19,61.07 arc(47.49,61.02) 47.74,60.85 arc(47.79,60.77) 47.81,60.68 47.81,60.59 arc(47.77,60.42) v1(47.68,60.28)
HDMI_TX_HPD_PORT: length 39.1
  Top Layer w0.152: JP2.53 44.56,58.05 v1(44.56,57.18)
  Top Layer w0.17: 7.49,54.27 v1(8.39,54.27)
  L2SP_INR w0.137: v1(44.56,57.18) 41.64,54.27 v1(8.39,54.27)
HDMI_TXCLK_N: length 53.6
  Top Layer w0.124: JP2.90 51.75,62.05 arc(51.77,62.15) v1(51.83,62.23)
  Top Layer w0.17: U10.12 5.73,52.87 arc(5.56,52.9) v1(5.42,53)
  Bottom Layer w0.124: v1(5.42,53) 6.43,53 arc(6.6,53.03) 6.74,53.12 arc(6.81,53.24) 6.84,53.38 6.84,53.66 arc(6.92,54.06) 7.15,54.41 7.74,55 arc(8.13,55.26) 8.58,55.35 19.14,55.35 arc(19.89,55.5) 20.53,55.92 27.23,62.62 arc(28.14,63.23) 29.22,63.45 51.01,63.45 arc(51.14,63.42) 51.24,63.35 51.56,63.04 arc(51.63,62.93) 51.66,62.8 51.66,62.5 arc(51.67,62.41) 51.73,62.33 v1(51.83,62.23)
HDMI_TXCLK_P: length 53.6
  Top Layer w0.124: JP2.88 51.35,62.03 arc(51.33,62.14) v1(51.27,62.23)
  Top Layer w0.17: 7.49,52.67 8.03,52.67 arc(8.32,52.72) v1(8.6,52.82)
  Bottom Layer w0.124: v1(8.6,52.82) 7.62,52.82 arc(7.45,52.86) 7.3,52.95 arc(7.2,53.1) 7.17,53.28 7.17,53.65 arc(7.23,53.94) 7.39,54.19 7.95,54.74 arc(8.26,54.95) 8.62,55.02 9.07,55.02 arc(9.23,54.95) 9.3,54.79 9.3,54.69 arc(9.53,54.46) 9.75,54.69 9.75,54.79 arc(9.82,54.95) 9.98,55.02 19.14,55.02 arc(20.02,55.19) 20.76,55.69 27.45,62.38 arc(28.27,62.93) 29.24,63.12 50.93,63.12 arc(51,63.11) 51.07,63.06 51.26,62.87 arc(51.31,62.8) 51.33,62.71 51.33,62.36 arc(51.31,62.29) v1(51.27,62.23)
HDMI_TXDDC_SCL_PORT: length 52.1
  Top Layer w0.152: 53.89,61.93 53.75,61.8 JP2.100
  Top Layer w0.17: 7.49,53.47 7.71,53.47 arc(8,53.53) v1(8.25,53.69)
  Bottom Layer w0.17: v1(8.25,53.69) 8.41,53.86 19.68,53.86 27.81,61.99 33.9,61.99 34.27,62.36 46.94,62.36 47.23,62.64 49.8,62.64 50.3,62.14 50.3,61.65 50.75,61.2 53.15,61.2 53.89,61.93 v1(53.89,61.94)
HDMI_TXDDC_SDA_PORT: length 61.9
  Top Layer w0.152: JP2.99 53.75,58.63 53.89,58.76 v1(53.89,58.77)
  Top Layer w0.17: U10.16 5.98,53.67 arc(5.61,53.74) v1(5.29,53.96)
  Bottom Layer w0.17: v1(5.29,53.96) 4.65,54.59 4.65,56.07 12.7,64.12 52.8,64.12 54.34,62.58 54.34,59.23 v1(53.89,58.77)
HP_SNS: length 86.1
  Top Layer w0.17: JP3.8 18.87,43.68 18.96,43.58 19.36,43.58 v1(19.41,43.63)
  Bottom Layer w0.157: v1(19.41,43.63) 19.05,43.63 18.09,44.59 18.09,45.79 18.59,46.29 19.52,46.29 21.15,44.66 21.15,35.97 38.06,19.06 47.58,19.06 50.14,16.51 76.16,16.51 v2(77.05,15.62) 78.69,15.62 79.28,15.03 U9.1
HPL_OUT: length 78.1
  Top Layer w0.17: JP3.6 v1(19.17,44.08)
  Bottom Layer w0.156: v2(72.39,12.79) 73.68,11.5 U9.2
  Bottom Layer w0.157: v1(19.17,44.08) 19.17,44.11 18.55,44.74 18.55,45.52 18.69,45.67 19.17,45.67 20.58,44.26 20.58,35.9 37.87,18.61 47.41,18.61 53.23,12.79 v2(72.39,12.79)
HPR_OUT: length 101.9
  Top Layer w0.158: JP3.4 18.99,44.48 v1(19.19,44.67)
  L2SP_INR w0.137: v1(19.19,44.67) 18.38,44.67 15.25,41.54 15.25,34.03 v2(7.52,26.31)
  Bottom Layer w0.156: v2(72.39,5.46) 73.57,5.46 U9.3
  Bottom Layer w0.157: v1(19.19,44.67) 19.88,43.98 19.88,35.97 37.65,18.2 47.03,18.2 59.78,5.46 v2(72.39,5.46)
LED1#: length 29
  Top Layer w0.17: 54.55,80.94 v2(54.55,82.03)
  L2SP_INR w0.137: v2(61.52,68.54) 61.52,68.54 arc(62.34,69.1) 63.31,69.29 65.24,69.29 arc(66.19,69.48) 66.99,70.01 67.48,70.51 arc(68.02,71.31) 68.21,72.25 68.21,74.62 arc(68.01,75.59) 67.46,76.42 64.27,79.6 arc(63.45,80.15) 62.48,80.35 57.22,80.35 arc(56.31,80.53) 55.53,81.05 v2(54.55,82.03)
MIC1_IN: length 139.1
  Top Layer w0.17: JP3.10 18.93,43.28 arc(19.07,43.25) v1(19.18,43.17)
  Top Layer w0.254: R9.1 v2(5.45,6.7)
  L2SP_INR w0.137: v1(19.18,43.17) 17.89,43.17 15.79,41.08 15.79,29.2 v3(1.57,14.98)
  Bottom Layer w0.157: v2(5.45,6.7) 5.45,7.56 arc(5.25,8.53) 4.7,9.36 2.32,11.74 arc(1.77,12.57) 1.57,13.54 v3(1.57,14.98) ; U9.4 74.87,7.5 78.33,7.5 78.99,6.84 78.99,2.1 78.17,1.28 74.95,1.28 71.32,4.91 59.56,4.91 46.71,17.77 37.45,17.77 19.51,35.71 19.51,42.84 v1(19.18,43.17)
MIPI_CSI_RX_D2N: length 3.7
  Top Layer w0.17: JP2.33 40.55,59.06 39.35,60.26 JP2.28
MIPI_CSI_RX_D2P: length 3.7
  Top Layer w0.17: JP2.30 39.75,60.38 40.95,59.18 JP2.35
MIPI_CSI_RX_D3N: length 3.7
  Top Layer w0.17: JP2.34 40.55,60.24 41.75,59.04 JP2.39
MIPI_CSI_RX_D3P: length 3.7
  Top Layer w0.17: JP2.36 40.95,60.34 42.15,59.14 JP2.41
PMIC_PWRON: length 3.8
  Top Layer w0.17: WAKE.1 55.04,21.44 53.75,22.73 JP1.99
SARADC_VIN1: length 56.5
  Top Layer w0.158: v1(47.75,27.9) 47.75,27.89 47.75,27.32
  Top Layer w0.17: v2(5.45,5.83) 2.59,5.83 C5.2
  L2SP_INR w0.203: v1(47.75,27.9) 46.58,26.73 23.67,26.73 6.1,9.15 6.1,6.48 v2(5.45,5.83)
SPEAKER+: length 7.5
  Top Layer w0.254: 5.75,36.23 6.46,36.23 6.66,36.03 U1.8
  Top Layer w0.508: SPEAKER.1 1.57,34.9 2.91,36.23 5.75,36.23
  vias: v2(0.96,34.7) v2(0.96,33.3) v2(2.19,34.7) v2(2.19,33.3)
SPEAKER-: length 15
  Top Layer w0.254: v2(10.31,33.41) 10.31,36.04 9.9,36.45 8.92,36.45 8.61,36.14 U1.5
  Bottom Layer w0.158: v2(2.19,30.12) 4.73,32.67 arc(5.56,33.22) 6.53,33.41 v2(10.31,33.41)
  vias: v2(0.96,30.12) v2(0.96,28.73) v2(2.19,28.73)
USB2_HOST2_N: length 51.7
  Top Layer w0.106: 15.55,43.28 14.19,43.28 v1(14.01,43.46)
  Bottom Layer w0.124: v1(14.01,43.46) 13.85,43.46 arc(13.72,43.43) 13.61,43.36 arc(13.5,43.28) 13.37,43.26 12.75,43.26 arc(12.61,43.32) 12.55,43.46 arc(12.49,43.6) 12.35,43.66 12.3,43.66 arc(12.15,43.6) 12.09,43.46 arc(12.03,43.32) 11.89,43.26 5.97,43.26 arc(5,43.45) 4.17,44 1.61,46.57 arc(1.05,47.39) 0.86,48.36 0.86,70.9 arc(0.98,71.48) 1.31,71.98 3,73.67 arc(3.5,74) 4.08,74.12 5.08,74.12 arc(6.17,74.33) 7.09,74.95 7.41,75.27 arc(7.83,75.9) 7.98,76.64 7.98,77.52 arc(8,77.63) 8.06,77.72 8.13,77.79 arc(8.22,77.85) v2(8.33,77.87)
USB2_HOST2_P: length 51.7
  Top Layer w0.106: v1(14.01,42.73) 14.16,42.88 JP3.11
  Bottom Layer w0.124: v1(14.01,42.73) 13.85,42.73 arc(13.72,42.76) 13.61,42.83 arc(13.5,42.9) 13.37,42.93 5.88,42.93 arc(4.86,43.13) 4,43.71 1.34,46.37 arc(0.74,47.26) 0.53,48.32 0.53,70.96 arc(0.66,71.61) 1.03,72.17 2.77,73.9 arc(3.37,74.3) 4.08,74.45 5.07,74.45 arc(6.04,74.64) 6.87,75.19 7.16,75.48 arc(7.52,76.03) 7.65,76.67 7.65,77.42 arc(7.63,77.54) 7.56,77.64 v2(7.33,77.87)
USB2_HOST3_N: length 94.5
  Top Layer w0.106: JP3.3 16.21,44.48 arc(16.36,44.51) v1(16.48,44.59)
  Bottom Layer w0.124: v1(16.48,44.59) 16.67,44.59 arc(16.78,44.57) 16.87,44.51 arc(16.96,44.45) 17.06,44.43 17.08,44.43 arc(17.2,44.4) 17.31,44.33 17.91,43.73 arc(18.03,43.54) 18.08,43.31 18.08,36.02 arc(18.14,35.74) 18.3,35.49 36.76,17.03 arc(36.99,16.88) 37.26,16.82 44.03,16.82 arc(44.47,16.74) 44.84,16.49 52.37,8.96 arc(52.63,8.56) 52.73,8.1 52.73,4.47 arc(52.65,4.1) 52.44,3.79 51.87,3.22 arc(51.53,2.99) 51.14,2.92 49.35,2.92 arc(48.98,2.99) 48.66,3.2 47.32,4.54 arc(47.19,4.74) 47.15,4.97 47.15,9.25 arc(47.03,9.82) 46.71,10.3 46.07,10.94 arc(45.62,11.24) 45.09,11.35 42.89,11.35 arc(42.26,11.22) 41.72,10.86 41.59,10.73 arc(41.45,10.53) 41.41,10.3 41.41,9.93 arc(41.42,9.86) 41.47,9.79 41.63,9.63 arc(41.67,9.6) v1(41.71,9.59) 41.55,9.43 arc(41.44,9.26) 41.4,9.05 41.4,7.05 arc(41.41,6.98) v1(41.45,6.91) arc(41.39,6.81) 41.37,6.7 41.37,6.46 arc(41.38,6.4) 41.41,6.35 ; v1(40.95,5.21) arc(41.02,5.11) 41.04,5 41.04,4.75 arc(41.03,4.7) 41,4.66 40.93,4.59 arc(40.81,4.41) 40.77,4.2 40.77,3.51 arc(40.85,3.11) 41.08,2.77 41.31,2.53 arc(41.61,2.33) 41.97,2.26 42.6,2.26 arc(42.92,2.33) 43.19,2.51 43.58,2.9 arc(43.79,3.22) 43.87,3.6 43.87,4.11 arc(43.78,4.55) 43.54,4.91 43.38,5.07 arc(43.34,5.13) 43.32,5.2 43.32,5.56 arc(43.27,5.82) 43.12,6.05 43.06,6.11 arc(42.84,6.26) 42.57,6.31 41.51,6.31 arc(41.46,6.32) 41.41,6.35
USB2_HOST3_P: length 93
  Top Layer w0.106: JP3.5 16.15,44.08 arc(16.33,44.04) v1(16.49,43.94)
  Bottom Layer w0.124: v1(16.49,43.94) 16.67,43.94 arc(16.78,43.96) 16.87,44.02 16.91,44.06 arc(16.96,44.09) 17.01,44.1 17.05,44.1 arc(17.07,44.09) 17.1,44.08 17.58,43.6 arc(17.71,43.41) 17.75,43.18 17.75,35.94 arc(17.82,35.6) 18.01,35.32 36.57,16.75 arc(36.86,16.56) 37.2,16.5 44.03,16.5 arc(44.34,16.43) 44.61,16.26 52.03,8.84 arc(52.3,8.43) 52.4,7.94 52.4,4.52 arc(52.34,4.23) 52.18,3.99 51.64,3.45 arc(51.41,3.3) 51.13,3.24 49.42,3.24 arc(49.11,3.3) 48.85,3.48 47.61,4.72 arc(47.51,4.87) 47.47,5.05 47.47,9.31 arc(47.34,9.95) 46.98,10.49 46.31,11.17 arc(45.75,11.55) 45.09,11.68 42.89,11.68 arc(42.13,11.52) 41.49,11.09 41.36,10.96 arc(41.15,10.66) 41.08,10.3 41.08,9.91 arc(41.05,9.79) 40.98,9.68 arc(40.88,9.61) 40.77,9.59 v1(40.75,9.59) 40.94,9.4 arc(41.04,9.26) 41.07,9.09 41.07,7.2 arc(41.04,7.05) v1(40.95,6.91) arc(41.01,6.81) 41.04,6.7 41.04,6.46 arc(41.07,6.28) 41.18,6.12 ; v1(41.45,5.21) arc(41.39,5.11) 41.37,5 41.37,4.75 arc(41.33,4.58) 41.23,4.43 41.16,4.36 arc(41.11,4.29) 41.1,4.2 41.1,3.51 arc(41.15,3.24) 41.31,3 41.54,2.77 arc(41.74,2.64) 41.97,2.59 42.6,2.59 arc(42.79,2.63) 42.96,2.74 43.35,3.13 arc(43.49,3.34) 43.54,3.6 43.54,4.11 arc(43.48,4.42) 43.3,4.68 43.15,4.84 arc(43.04,5.01) 43,5.2 43,5.56 arc(42.97,5.7) 42.89,5.81 42.83,5.88 arc(42.71,5.96) 42.57,5.98 41.51,5.98 arc(41.33,6.02) 41.18,6.12
USB3_HOST1_N: length 100.9
  Top Layer w0.106: v1(14.03,41.46) 14.2,41.28 JP3.19
  Top Layer w0.17: CN2.9 54.8,72.48 arc(54.77,72.34) v1(54.69,72.23)
  Bottom Layer w0.124: v1(54.69,72.23) 54.83,72.09 arc(54.88,72.01) 54.9,71.91 54.9,71.23 arc(54.93,71.1) 55,71 55.48,70.52 arc(55.69,70.38) 55.94,70.33 56.49,70.33 arc(56.65,70.26) 56.71,70.11 arc(56.77,69.96) 56.93,69.89 56.95,69.89 arc(57.1,69.96) 57.17,70.11 arc(57.23,70.26) 57.38,70.33 60.67,70.33 arc(61.18,70.43) 61.61,70.72 64.15,73.25 arc(64.82,73.7) 65.62,73.86 66.8,73.86 arc(67.16,73.79) 67.47,73.59 69.43,71.62 arc(69.98,70.8) 70.17,69.83 70.17,57.4 arc(70.13,57.19) 70,57 68.03,55.03 arc(67.62,54.75) 67.13,54.66 25.38,54.66 arc(24.78,54.54) 24.27,54.2 16.03,45.96 arc(15.72,45.5) 15.62,44.97 15.62,42.07 arc(15.57,41.84) 15.44,41.64 15.16,41.35 arc(15.05,41.28) 14.92,41.26 14.67,41.26 arc(14.54,41.28) 14.43,41.36 arc(14.32,41.43) 14.18,41.46 v1(14.03,41.46)
USB3_HOST1_P: length 100.9
  Top Layer w0.106: v1(14.03,40.73) 14.18,40.88 JP3.21
  Top Layer w0.17: CN2.7 55.3,72.48 arc(55.32,72.34) v1(55.4,72.23)
  Bottom Layer w0.124: v1(55.4,72.23) 55.33,72.16 arc(55.26,72.04) 55.23,71.91 55.23,71.38 arc(55.26,71.24) 55.33,71.13 55.71,70.75 arc(55.82,70.68) 55.95,70.66 60.64,70.66 arc(61.05,70.74) 61.41,70.97 ; 61.41,70.97 63.99,73.56 arc(64.69,74.02) 65.52,74.19 66.81,74.19 arc(67.29,74.09) 67.69,73.82 69.75,71.76 arc(70.3,70.94) 70.5,69.96 70.5,57.39 arc(70.43,57.06) 70.25,56.78 68.24,54.78 arc(67.75,54.45) 67.16,54.33 25.39,54.33 arc(24.9,54.23) 24.49,53.96 16.32,45.78 arc(16.04,45.37) 15.95,44.89 15.95,42.02 arc(15.88,41.71) 15.71,41.44 15.29,41.02 arc(15.18,40.95) 15.06,40.93 14.67,40.93 arc(14.54,40.9) 14.43,40.83 arc(14.32,40.75) 14.19,40.73 v1(14.03,40.73)
USIM_CLK: length 40.5
  Top Layer w0.17: 49.05,80.94 49.05,82.26 arc(49.06,82.34) v1(49.11,82.42)
  Bottom Layer w0.157: v2(46.65,67.14) 47.44,66.35 arc(48.27,65.8) 49.24,65.6 v2(66.34,65.6)
  Bottom Layer w0.158: v1(49.11,82.42) 49.11,80.57 arc(48.92,79.59) 48.37,78.77 44.29,74.69 arc(43.74,73.87) 43.55,72.89 43.55,70.78 arc(43.74,69.8) 44.29,68.98 45.3,67.97 arc(45.57,67.79) 45.88,67.73 arc(46.05,67.7) 46.18,67.61 v2(46.65,67.14)
USIM_DATA: length 46.4
  Top Layer w0.17: 48.55,80.94 48.55,82.12 arc(48.51,82.28) v1(48.42,82.41)
  Bottom Layer w0.157: v2(66.34,66.87) 66.91,66.87 arc(67.01,66.86) 67.09,66.8 67.27,66.62 arc(67.43,66.39) 67.48,66.11 67.48,65.47 arc(67.42,65.19) 67.27,64.95 arc(66.94,64.73) 66.55,64.66 48.29,64.66 arc(47.31,64.85) 46.49,65.4 v2(44.75,67.14)
  Bottom Layer w0.158: v1(48.42,82.41) 48.42,81.2 arc(48.23,80.23) 47.68,79.41 42.77,74.49 arc(42.39,73.93) 42.26,73.26 42.26,70.69 arc(42.45,69.71) 43,68.89 v2(44.75,67.14)
USIM_RST: length 37.8
  Top Layer w0.17: v2(49.69,82.08) 49.55,81.94 49.55,80.94
  Bottom Layer w0.157: v2(44.75,69.68) 45.9,68.52 arc(46.73,67.97) 47.7,67.78 65.45,67.78 arc(65.93,67.87) v2(66.34,68.14)
  Bottom Layer w0.158: v2(44.75,69.68) 44.75,72.57 arc(44.94,73.54) 45.49,74.36 48.94,77.82 arc(49.49,78.64) 49.69,79.61 v2(49.69,82.08)
USIM_VDD: length 34.4
  Top Layer w0.254: v2(47.82,82.14) 48.05,81.91 48.05,80.94
  L2SP_INR w0.137: v2(46.65,69.68) 46.65,79.91 arc(46.84,80.88) 47.39,81.71 v2(47.82,82.14)
  Bottom Layer w0.157: v2(66.34,70.68) 65.71,70.06 arc(64.89,69.51) 63.92,69.32 47.46,69.32 arc(47.04,69.4) 46.69,69.63 v2(46.65,69.68)
V_USB: length 14.2
  Top Layer w0.17: USB1.A9 v1(42.45,5.21) ; USB1.A4 v1(39.95,5.21)
  L2SP_INR w0.203: v1(37.45,9.24) 38.2,8.49 38.2,6.96 v1(39.95,5.21)
  L2SP_INR w0.254: v1(39.95,5.21) 39.95,4.28 40.7,3.53 42.35,3.53 42.88,4.05 42.88,4.78 v1(42.45,5.21)
VUSB: length 14.5
  L2SP_INR w0.254: v2(13.72,9.77) 19.84,15.9 19.84,18.11 21.85,20.12 v3(22.61,20.12)
$1N4419: length 2.4
  Top Layer w0.17: 76.32,58.64 73.91,58.64 R25.2
$1N4460: length 2.8
  Top Layer w0.17: 76.32,56.1 75.46,55.24 R26.2
$2N2: length 205.3
  Top Layer w0.17: CAMERA_ON.1 58.27,3.95 v2(58.27,3.95)
  L2SP_INR w0.137: v2(58.27,3.95) 50.18,3.95 47.06,0.83 33.72,0.83 31.03,3.53 9.78,3.53 9.13,2.87 5.06,2.87 2.45,5.48 2.45,7.82 16.04,21.4 16.98,21.4 36.21,40.63 44.99,40.63 59.02,54.66 59.02,61.56 56.69,63.89 26.16,63.89 12.18,77.87 v2(9.33,77.87)
$2N7: length 2.6
  Top Layer w0.17: U1.3 U1.2 C3.2
$2N10: length 5.1
  Top Layer w0.17: R10.2 U1.4 9.76,30.88 10.31,31.44 10.31,32.55
$2N12: length 2.6
  Top Layer w0.17: C1.2 9.42,5.8 R8.1 6.86,5.8 6.83,5.83
$2N528: length 1.6
  Top Layer w0.17: R10.1 C2.2
$2N1557: length 3.2
  Bottom Layer w0.158: v2(8.14,6.67) 8.14,6.36 arc(7.94,5.39) 7.39,4.56 v2(6.78,3.96)
$3N6118: length 6.9
  Top Layer w0.17: v1(51.3,73.39) 51.3,70.87 51.95,70.21 v2(51.95,70.11) 50.25,70.11 RING_IND1.1
$3N9431: length 2.8
  Top Layer w0.508: LED_SIM_STATUS1.2 59.49,68.51 59.52,68.54
$4N10: length 16.9
  Top Layer w0.889: v3(28.22,73.2) R19.1
  Bottom Layer w0.158: v3(28.22,73.2) 27.45,73.97 17.38,73.97 v3(15.42,72)
$4N12: length 2.1
  Top Layer w0.17: U3.2 19.19,10.74 18.76,11.17 LED1.1
$4N15: length 3.3
  Top Layer w0.17: L1.1 26.15,11.15 25.73,10.74
$4N20: length 3.3
  Top Layer w0.17: R12.1 R13.1 ; U3.5 25.69,6.54
$4N24: length 12.1
  Top Layer w0.15: v2(44.56,12.89) 43.56,11.89 R22.1
  Top Layer w0.17: 41.95,5.08 v1(41.95,4.35)
  L2SP_INR w0.137: v2(44.56,12.89) 43.99,12.32 arc(43.44,11.49) 43.24,10.52 43.24,8.43 arc(43.05,7.47) 42.51,6.66 arc(42.09,6.04) 41.95,5.3 v1(41.95,4.35)
$4N26: length 9.7
  Top Layer w0.15: v2(38.78,12.89) 39.78,11.89 R23.2
  Top Layer w0.17: 40.45,6.78 v1(40.45,6.27)
  L2SP_INR w0.137: v1(40.45,6.27) 39.87,6.85 arc(39.06,8.05) 38.78,9.48 v2(38.78,12.89)
$4N691: length 2.3
  Top Layer w0.17: R5.2 15.99,16.97 C6.2
$4N693: length 2.3
  Top Layer w0.17: R12.2 LED2.1
$4N694: length 8.8
  Top Layer w0.17: R13.2 18.41,4.9 POWERON/OFF.3
$4N11643: length 2.3
  Top Layer w0.17: R6.2 33.26,6.81 C10.2

## Copper pours and planes (outline as drawn; the poured copper is in the pictures)
+5V on Bottom Layer: 5.7,37.87 5.7,36.47 6.91,35.26 10.13,35.26 12.43,32.95 12.43,23.68 24.63,11.48 31.47,11.48 31.47,17.4 11.01,37.87
+5V on L2SP_INR: 7.92,62.6 1.37,56.05 1.37,47.28 9.8,38.85 9.8,35.69 0.01,35.69 0.01,79.53 4.99,79.53 16.43,68.09 16.43,64.59 14.43,62.6
+5V on L2SP_INR: 80.99,19.62 80.99,11.75 75.56,6.33 51.94,6.33 43.97,14.29 36.43,14.29 27.18,5.04 14.44,5.04 14.44,9.25 25.7,20.52 75.62,20.52 78.06,19.62
GND on L3PN_GND: 36.1,4.49 37.56,4.49 37.56,3.28 36.1,3.28
GND on L3PN_GND: 2.08,57.22 3.36,57.22 3.36,55.67 2.08,55.67
GND on L3PN_GND: 34.85,4.49 36.31,4.49 36.31,3.28 34.85,3.28
GND on L3PN_GND: 5.5,49.21 6.68,49.21 6.68,47.77 5.5,47.77
GND on L3PN_GND: 43.85,4.49 45.31,4.49 45.31,3.28 43.85,3.28
GND on L3PN_GND: 45.1,4.49 46.56,4.49 46.56,3.28 45.1,3.28
GND on L3PN_GND: 5.5,57.16 6.68,57.16 6.68,55.73 5.5,55.73
GND on L3PN_GND: 2.08,51.02 3.36,51.02 3.36,49.47 2.08,49.47
GND on L3PN_GND: 2.08,55.46 3.36,55.46 3.36,53.92 2.08,53.92
GND on L3PN_GND: 2.08,49.26 3.36,49.26 3.36,47.72 2.08,47.72
GND on L3PN_GND: 0.16,82.84 80.84,82.84 80.84,0.16 0.16,0.16
VBAT on Top Layer: 37.56,82.5 57.21,82.5 57.21,80.07 37.56,80.07

Small or netless copper shapes (teardrops, artwork), in the pictures only: 2 on L2SP_INR, 29 on L3PN_GND

## Text on the board
Bottom Silkscreen Layer: Thank you ER,CZ,FP,PC,PM,BP,BS,AF,AR<3,WN | OURphone v1.1
Top Silkscreen Layer: OFF | ON | M2_MODEM | HEADPHONE | UART_DEBUG | USB_WEBCAM | HDMI | + | - | Orange Pi CM4 | motherboard - receiving part
